# Altium schematic sheet Power.SchDoc
size A; SheetNumber: 4; SheetTotal: 5
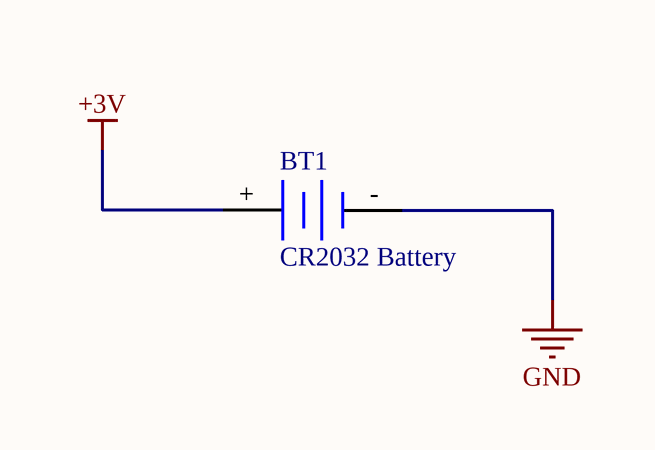
[diagram p0: Power.SchDoc]

## Parts
BT1  CR2032 Battery  [PCBComponent_1]

## Nets
+3V: BT1.+
GND: BT1.-

## Library data of the parts
BT1 = Battery: Multicell Battery; pin to pad: 1>+ 2>-; Published: 24-Mar-1999; LatestRevisionDate: 17-Jul-2002; LatestRevisionNote: Re-released for DXP Platform.; PackageReference: BAT-2; Publisher: Altium Limited; PackageDescription: Battery; 2 Leads; Supplier 1: Digi-Key; Supplier Part Number 1: 2057-BH-49E-5-BK-ND